# EAGLE schematic dwm1000 (1) (EAGLE 7.2.0)
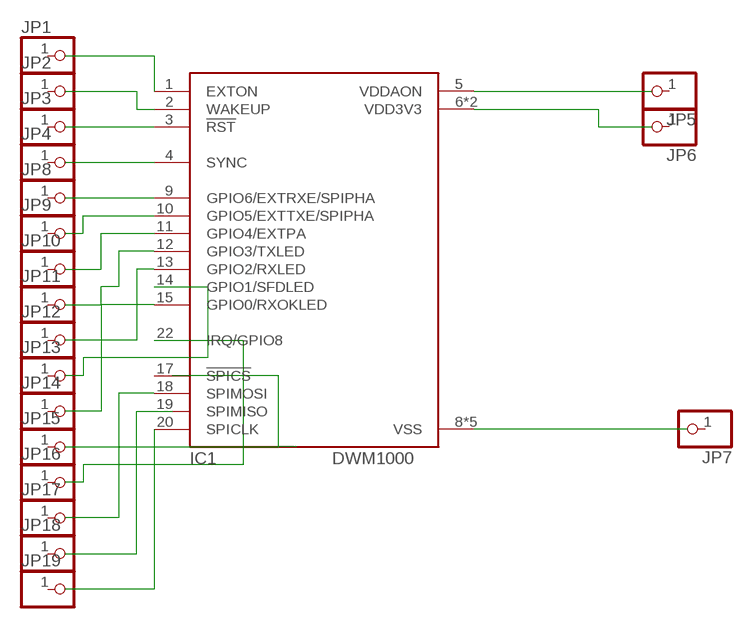
[diagram p0: schematic, sheet 1]

## Parts
IC1  DWM1000  [DWM1000]
JP1  PINHD-1X1_2.00  [1X01M]
JP2  PINHD-1X1_2.00  [1X01M]
JP3  PINHD-1X1_2.00  [1X01M]
JP4  PINHD-1X1_2.00  [1X01M]
JP5  PINHD-1X1_2.00  [1X01M]
JP6  PINHD-1X1_2.00  [1X01M]
JP7  PINHD-1X1_2.00  [1X01M]
JP8  PINHD-1X1_2.00  [1X01M]
JP9  PINHD-1X1_2.00  [1X01M]
JP10  PINHD-1X1_2.00  [1X01M]
JP11  PINHD-1X1_2.00  [1X01M]
JP12  PINHD-1X1_2.00  [1X01M]
JP13  PINHD-1X1_2.00  [1X01M]
JP14  PINHD-1X1_2.00  [1X01M]
JP15  PINHD-1X1_2.00  [1X01M]
JP16  PINHD-1X1_2.00  [1X01M]
JP17  PINHD-1X1_2.00  [1X01M]
JP18  PINHD-1X1_2.00  [1X01M]
JP19  PINHD-1X1_2.00  [1X01M]

## Nets
N$1: IC1.1(EXTON)
N$2: IC1.2(WAKEUP)
N$3: IC1.3(!RST)
N$4: IC1.4(SYNC)
N$5: IC1.5(VDDAON)
N$6: IC1.6(VDD3V3) IC1.7(VDD3V3)
N$7: IC1.8(VSS) IC1.16(VSS) IC1.21(VSS) IC1.23(VSS) IC1.24(VSS)
N$8: IC1.9(GPIO6/EXTRXE/SPIPHA)
N$9: IC1.10(GPIO5/EXTTXE/SPIPHA)
N$10: IC1.11(GPIO4/EXTPA)
N$11: IC1.12(GPIO3/TXLED)
N$12: IC1.15(GPIO0/RXOKLED)
N$13: IC1.13(GPIO2/RXLED)
N$14: IC1.14(GPIO1/SFDLED)
N$15: IC1.20(SPICLK)
N$17: IC1.18(SPIMOSI)
N$18: IC1.22(IRQ/GPIO8)
Unconnected: IC1.17(!SPICS) IC1.19(SPIMISO) JP1.1 JP2.1 JP3.1 JP4.1 JP5.1 JP6.1 JP7.1 JP8.1 JP9.1 JP10.1 JP11.1 JP12.1 JP13.1 JP14.1 JP15.1 JP16.1 JP17.1 JP18.1 JP19.1

## Library data of the parts
IC1 = decawave:DWM1000
JP1-JP19 = con-pinhead:PINHD-1X1: PIN HEADER